# Altium schematic sheet 04_RF_Diagram.SchDoc: RF diagram
size A4; Organization: Lime Microsystems; Address1: Surrey Tech Centre; Address2: Guildford GU2 7YG; Address3: Surrey; Address4: United Kingdom; Revision: v1.2; SheetNumber: 4; SheetTotal: 10
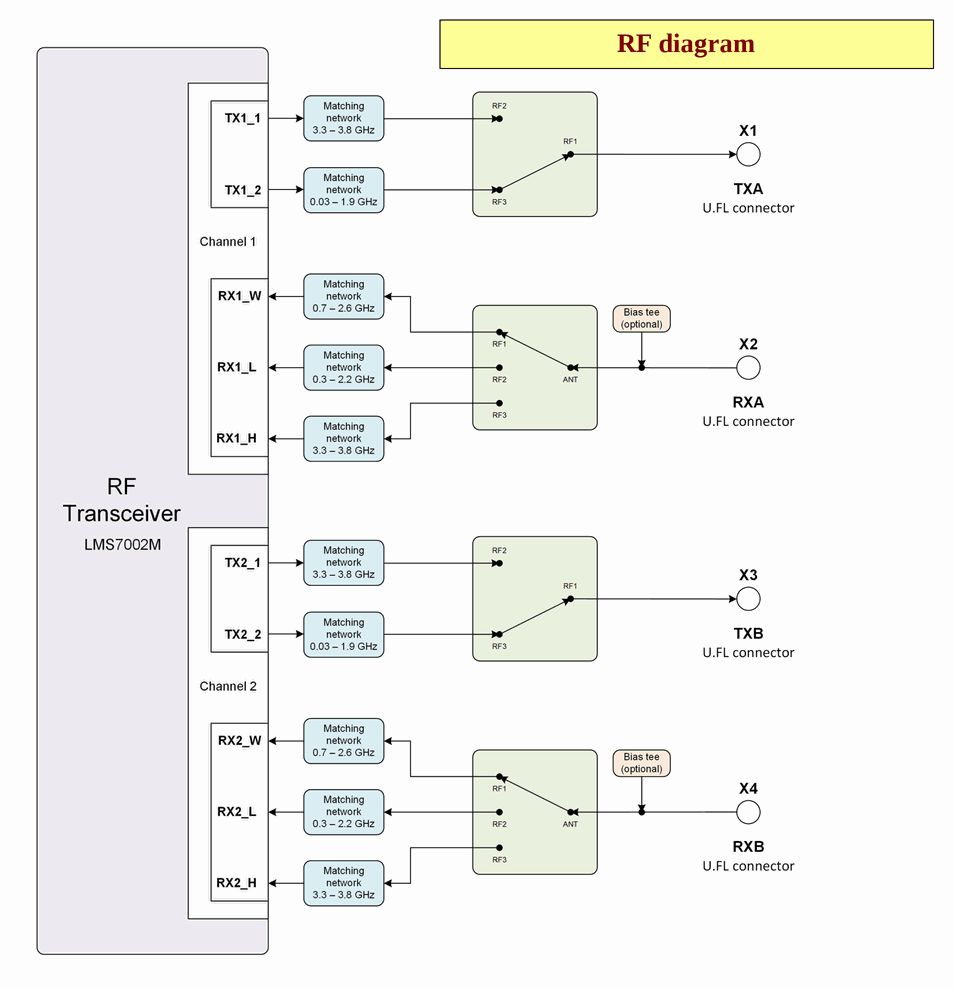
[diagram p0: 04_RF_Diagram.SchDoc]

## Notes on the sheet
- RF diagram
- Project name:
- Title:
- Size:
- Date:
- A4
- Revision:
- Time:
- Sheet
- of
- File: